# Altium schematic sheet mic.SchDoc
size A4
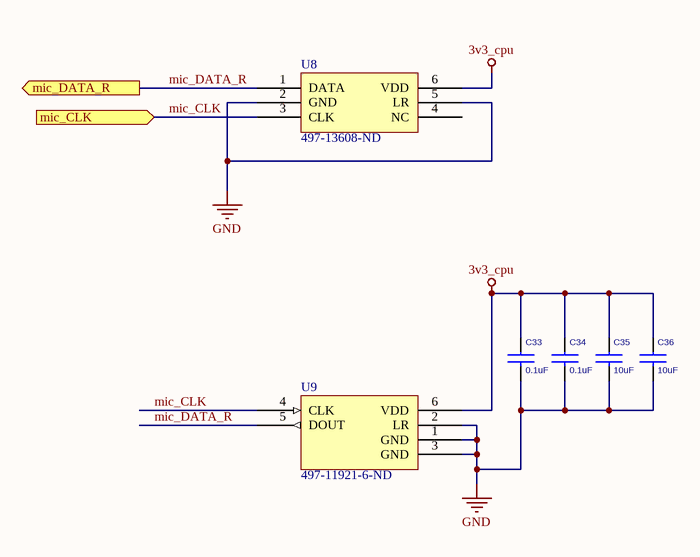
[diagram p0: mic.SchDoc]

## Parts
C33  0.1uF  [CAPC2012X09M]
C34  0.1uF  [CAPC2012X09M]
C35  10uF  [CAPC2012X09M]
C36  10uF  [CAPC2012X09M]
U8  Supplier Part Number 1: 497-13608-ND  [STEVAL-MKI129V1]  (hidden comment: STEVAL-MKI129V1)
U9  Supplier Part Number 1: 497-11921-6-ND  [LGA6C165P2X3_376X472X125]  (hidden comment: MP45DT02)

## Ports
mic_CLK (in), mic_DATA_R (out)

## Nets
3v3_cpu: C33.1 C34.1 C35.1 C36.1 U8.6(VDD) U9.6(VDD)
GND: C33.2 C34.2 C35.2 C36.2 U8.2(GND) U8.5(LR) U9.1(GND) U9.2(LR) U9.3(GND)
mic_CLK: U8.3(CLK) U9.4(CLK) ; port mic_CLK
mic_DATA_R: U8.1(DATA) U9.5(DOUT) ; port mic_DATA_R

Not connected (* = marked no-connect by the designer): U8 4(NC)

## Library data of the parts
C33 C34 = CAP_SMD_0.1UF_10%: CAP CER 0.1UF 25V 10% X7R 0805; Value: 0.1uF; Supplier 1: Digi-Key; Supplier Part Number 1: 399-1168-6-ND
C35 C36 = CAP_SMD_10UF_20%: CAP CER 10UF 16V 20% X5R 0805; Value: 10uF; Supplier 1: Digi-Key; Supplier Part Number 1: 399-8013-1-ND
U8 = STEVAL-MKI129V1: Supplier 1: Digi-Key
U9 = MP45DT02: Supplier 1: Digi-Key